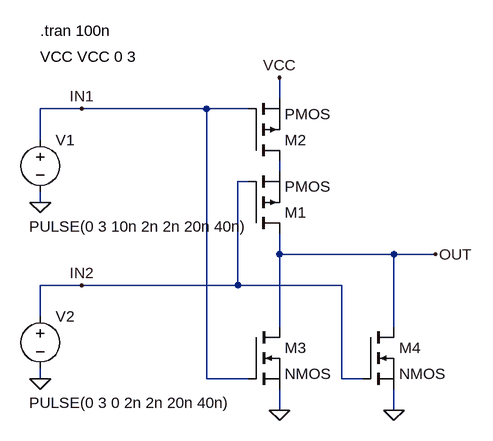
[diagram p0: schematic Fig_6-31_CMOS_NOR.asc]
Fig_6-31_CMOS_NOR.asc, the LTspice schematic file:
Version 4
SHEET 1 880 680
WIRE 192 -64 192 -96
WIRE -112 -48 -176 -48
WIRE 80 -48 -112 -48
WIRE 144 -48 80 -48
WIRE -176 0 -176 -48
WIRE 192 48 192 32
WIRE 144 64 128 64
WIRE -176 96 -176 80
WIRE 192 176 192 144
WIRE 368 176 192 176
WIRE 432 176 368 176
WIRE -112 224 -176 224
WIRE 128 224 128 64
WIRE 128 224 -112 224
WIRE 288 224 128 224
WIRE -176 272 -176 224
WIRE 192 288 192 176
WIRE 368 288 368 176
WIRE -176 368 -176 352
WIRE 80 368 80 -48
WIRE 144 368 80 368
WIRE 288 368 288 224
WIRE 320 368 288 368
WIRE 192 416 192 384
WIRE 368 416 368 384
FLAG 192 416 0
FLAG 432 176 OUT
FLAG -112 -48 IN1
FLAG 192 -96 VCC
FLAG -176 96 0
FLAG -112 224 IN2
FLAG -176 368 0
FLAG 368 416 0
SYMBOL pmos 144 32 M180
SYMATTR InstName M2
SYMBOL voltage -176 -16 R0
WINDOW 3 -17 149 Left 2
WINDOW 123 0 0 Left 2
WINDOW 39 0 0 Left 2
SYMATTR Value PULSE(0 3 10n 2n 2n 20n 40n)
SYMATTR InstName V1
SYMBOL nmos 144 288 R0
SYMATTR InstName M3
SYMBOL pmos 144 144 M180
SYMATTR InstName M1
SYMBOL voltage -176 256 R0
WINDOW 3 -17 149 Left 2
WINDOW 123 0 0 Left 2
WINDOW 39 0 0 Left 2
SYMATTR Value PULSE(0 3 0 2n 2n 20n 40n)
SYMATTR InstName V2
SYMBOL nmos 320 288 R0
SYMATTR InstName M4
TEXT -176 -128 Left 2 !VCC VCC 0 3
TEXT -176 -168 Left 2 !.tran 100n

The netlist it stands for:
* Fig_6-31_CMOS_NOR.asc
M2 N001 IN1 VCC VCC PMOS
V1 IN1 0 PULSE(0 3 10n 2n 2n 20n 40n)
M3 OUT IN1 0 0 NMOS
M1 OUT IN2 N001 N001 PMOS
V2 IN2 0 PULSE(0 3 0 2n 2n 20n 40n)
M4 OUT IN2 0 0 NMOS
.model NMOS NMOS
.model PMOS PMOS
.lib standard.mos
VCC VCC 0 3
.tran 100n
.backanno
.end